# Altium schematic sheet Nav_Retro_IO.SchDoc
size A
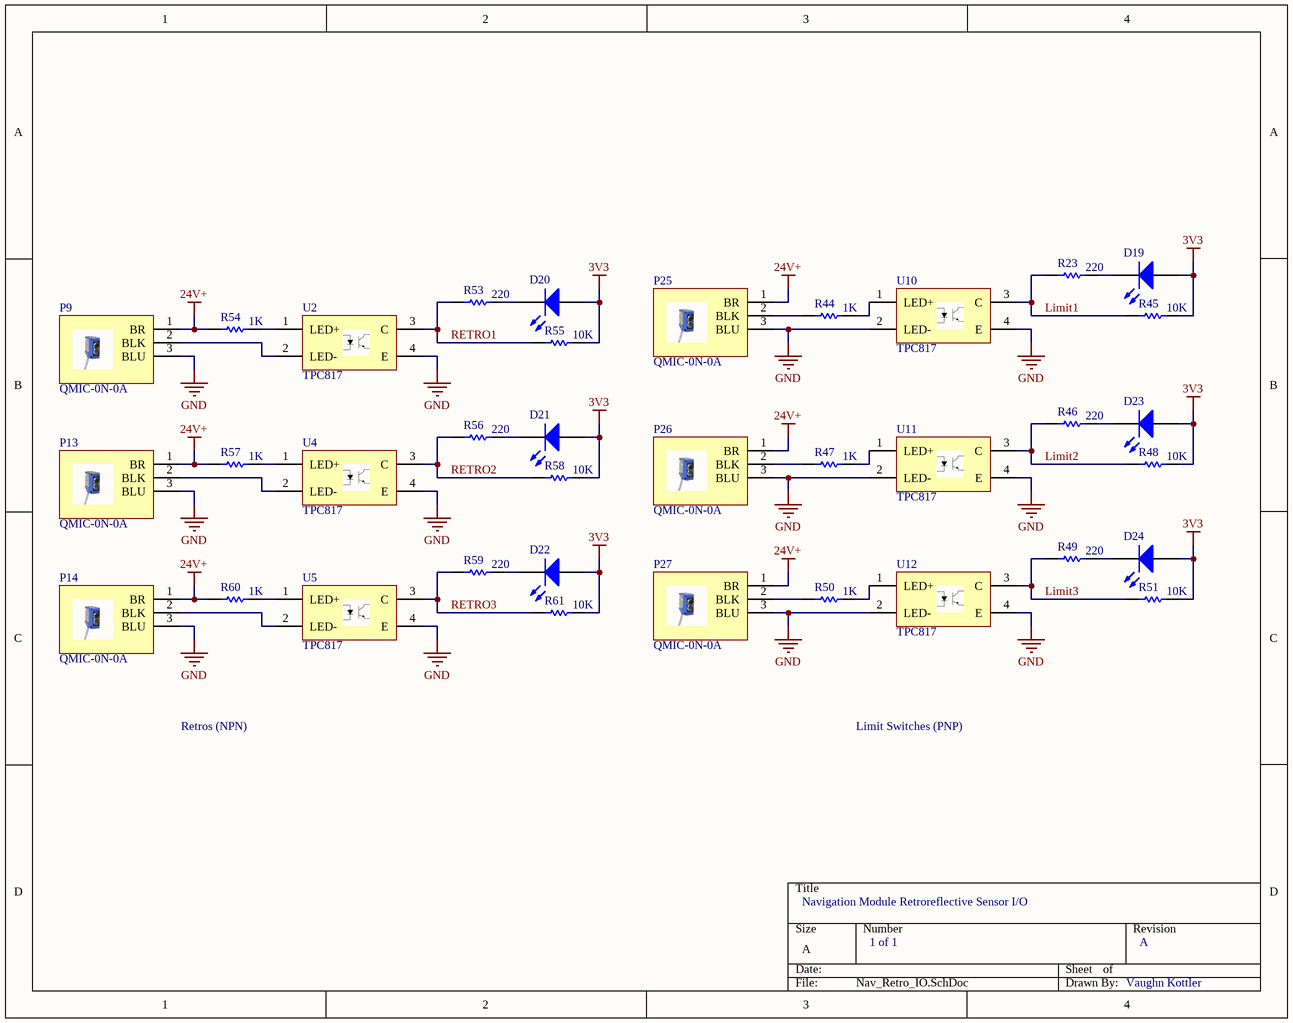
[diagram p0: Nav_Retro_IO.SchDoc]

## Parts
D19  LED2  [3.2X1.6X1.1]  (value not drawn)
D20  LED2  [3.2X1.6X1.1]  (value not drawn)
D21  LED2  [3.2X1.6X1.1]  (value not drawn)
D22  LED2  [3.2X1.6X1.1]  (value not drawn)
D23  LED2  [3.2X1.6X1.1]  (value not drawn)
D24  LED2  [3.2X1.6X1.1]  (value not drawn)
P9  QMIC-0N-0A  [3POS TERM BLOCK]
P13  QMIC-0N-0A  [3POS TERM BLOCK]
P14  QMIC-0N-0A  [3POS TERM BLOCK]
P25  QMIC-0N-0A  [3POS TERM BLOCK]
P26  QMIC-0N-0A  [3POS TERM BLOCK]
P27  QMIC-0N-0A  [3POS TERM BLOCK]
R23  value 220  [6-0805_M]  (hidden comment: Res1)
R44  value 1K  [6-0805_M]  (hidden comment: Res1)
R45  value 10K  [6-0805_M]  (hidden comment: Res1)
R46  value 220  [6-0805_M]  (hidden comment: Res1)
R47  value 1K  [6-0805_M]  (hidden comment: Res1)
R48  value 10K  [6-0805_M]  (hidden comment: Res1)
R49  value 220  [6-0805_M]  (hidden comment: Res1)
R50  value 1K  [6-0805_M]  (hidden comment: Res1)
R51  value 10K  [6-0805_M]  (hidden comment: Res1)
R53  value 220  [6-0805_M]  (hidden comment: Res1)
R54  value 1K  [6-0805_M]  (hidden comment: Res1)
R55  value 10K  [6-0805_M]  (hidden comment: Res1)
R56  value 220  [6-0805_M]  (hidden comment: Res1)
R57  value 1K  [6-0805_M]  (hidden comment: Res1)
R58  value 10K  [6-0805_M]  (hidden comment: Res1)
R59  value 220  [6-0805_M]  (hidden comment: Res1)
R60  value 1K  [6-0805_M]  (hidden comment: Res1)
R61  value 10K  [6-0805_M]  (hidden comment: Res1)
U2  TPC817  [4-SOP]
U4  TPC817  [4-SOP]
U5  TPC817  [4-SOP]
U10  TPC817  [4-SOP]
U11  TPC817  [4-SOP]
U12  TPC817  [4-SOP]

## Nets
3V3: D19.1(A) D20.1(A) D21.1(A) D22.1(A) D23.1(A) D24.1(A) R45.2 R48.2 R51.2 R55.2 R58.2 R61.2
24V+: P9.1(BR) P13.1(BR) P14.1(BR) P25.1(BR) P26.1(BR) P27.1(BR) R54.1 R57.1 R60.1
GND: P9.3(BLU) P13.3(BLU) P14.3(BLU) P25.3(BLU) P26.3(BLU) P27.3(BLU) U2.4(E) U4.4(E) U5.4(E) U10.2(LED-) U10.4(E) U11.2(LED-) U11.4(E) U12.2(LED-) U12.4(E)
Limit1: R23.1 R45.1 U10.3(C)
Limit2: R46.1 R48.1 U11.3(C)
Limit3: R49.1 R51.1 U12.3(C)
RETRO1: R53.1 R55.1 U2.3(C)
RETRO2: R56.1 R58.1 U4.3(C)
RETRO3: R59.1 R61.1 U5.3(C)
NetD19_2: D19.2(K) R23.2
NetD20_2: D20.2(K) R53.2
NetD21_2: D21.2(K) R56.2
NetD22_2: D22.2(K) R59.2
NetD23_2: D23.2(K) R46.2
NetD24_2: D24.2(K) R49.2
NetP9_2: P9.2(BLK) U2.2(LED-)
NetP13_2: P13.2(BLK) U4.2(LED-)
NetP14_2: P14.2(BLK) U5.2(LED-)
NetP25_2: P25.2(BLK) R44.1
NetP26_2: P26.2(BLK) R47.1
NetP27_2: P27.2(BLK) R50.1
NetR44_2: R44.2 U10.1(LED+)
NetR47_2: R47.2 U11.1(LED+)
NetR50_2: R50.2 U12.1(LED+)
NetR54_2: R54.2 U2.1(LED+)
NetR57_2: R57.2 U4.1(LED+)
NetR60_2: R60.2 U5.1(LED+)

## Notes on the sheet
- Retros (NPN)
- Limit Switches (PNP)
- Navigation Module Retroreflective Sensor I/O
- 1 of 1
- A
- Vaughn Kottler

## Library data of the parts
D19-D24 = LED2: Typical RED, GREEN, YELLOW, AMBER GaAs LED; Published: 8-Jun-2000; LatestRevisionDate: 17-Jul-2002; LatestRevisionNote: Re-released for DXP Platform.; PackageVersion: Feb-2002; PackageReference: 3.2X1.6X1.1; Publisher: Altium Limited; PackageDescription: SM LED; 2 Flat Leads
P9 P13 P14 P25-P27 = QMIC-0N-0A: Retroreflective Sensor; ComponentLink1Description: Sensor; ComponentLink1URL: https://www.automationdirect.com/adc/Shopping/Catalog/Sensors_-z-_Encoders/Photoelectric_Sensors/DC_Rectangular/Retroreflective_(QM-z-CX-z-FE_Series)/QMIC-0N-0A; ComponentLink2Description: Datasheet; ComponentLink2URL: https://cdn.automationdirect.com/static/specs/peminirectqm.pdf
R23 R44-R51 R53-R61 = Res1: Resistor; Published: 8-Jun-2000; LatestRevisionDate: 17-Jul-2002; LatestRevisionNote: Re-released for DXP Platform.; PackageReference: AXIAL-0.3; Publisher: Altium Limited; PackageDescription: Axial Device, Thru-Hole; 2 Leads; 0.3 in Pin Spacing
U2 U4 U5 U10-U12 = TPC817: Opto-Coupler; ComponentLink1Description: Digi-Key; ComponentLink1URL: https://www.digikey.com/product-detail/en/taiwan-semiconductor-corporation/TPC817S1D-RAG/TPC817S1D-RAGCT-ND/7359685; ComponentLink2Description: Datasheet; ComponentLink2URL: http://www.taiwansemi.com/products/datasheet/TPC817%20SERIES_C1612.pdf